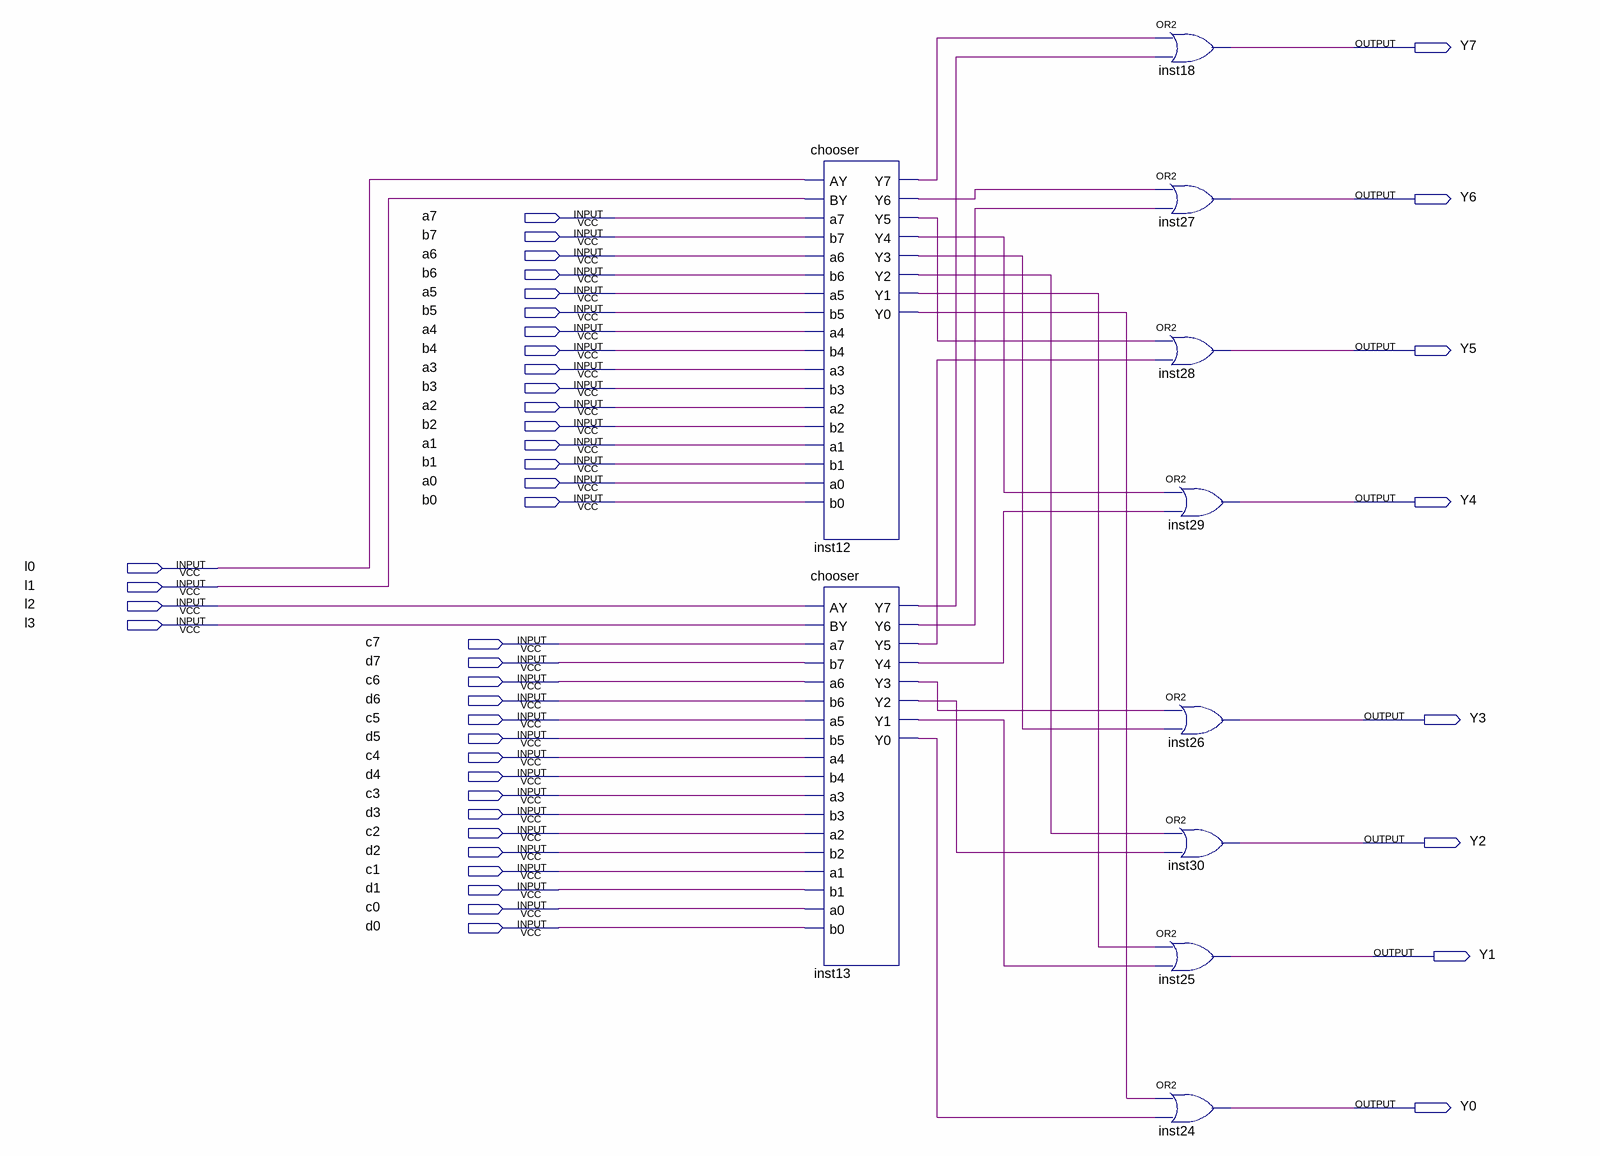
[diagram p0: schematic sheet]
// Quartus schematic chooser4-1.bdf as structural Verilog: 10 symbols, 44 pins
module \chooser4-1  (
  input  a7,
  input  b7,
  input  a6,
  input  b6,
  input  a5,
  input  b5,
  input  a4,
  input  b4,
  input  a3,
  input  b3,
  input  a2,
  input  b2,
  input  a1,
  input  b1,
  input  a0,
  input  b0,
  input  l0,
  input  l1,
  input  l2,
  input  l3,
  input  c7,
  input  d7,
  input  c6,
  input  d6,
  input  c5,
  input  d5,
  input  c4,
  input  d4,
  input  c3,
  input  d3,
  input  c2,
  input  d2,
  input  c1,
  input  d1,
  input  c0,
  input  d0,
  output Y7,
  output Y6,
  output Y5,
  output Y4,
  output Y3,
  output Y2,
  output Y1,
  output Y0
);

  wire inst12_y0, inst12_y1, inst12_y2, inst12_y3, inst12_y4, inst12_y5, inst12_y6, inst12_y7, inst13_y0,
       inst13_y1, inst13_y2, inst13_y3, inst13_y4, inst13_y5, inst13_y6, inst13_y7;

  chooser inst12 (
    .AY(l0), .BY(l1), .a7(a7), .b7(b7), .a6(a6), .b6(b6), .a5(a5), .b5(b5), .a4(a4), .b4(b4), .a3(a3),
    .b3(b3), .a2(a2), .b2(b2), .a1(a1), .b1(b1), .a0(a0), .b0(b0), .Y7(inst12_y7), .Y6(inst12_y6),
    .Y5(inst12_y5), .Y4(inst12_y4), .Y3(inst12_y3), .Y2(inst12_y2), .Y1(inst12_y1), .Y0(inst12_y0));
  chooser inst13 (
    .AY(l2), .BY(l3), .a7(c7), .b7(d7), .a6(c6), .b6(d6), .a5(c5), .b5(d5), .a4(c4), .b4(d4), .a3(c3),
    .b3(d3), .a2(c2), .b2(d2), .a1(c1), .b1(d1), .a0(c0), .b0(d0), .Y7(inst13_y7), .Y6(inst13_y6),
    .Y5(inst13_y5), .Y4(inst13_y4), .Y3(inst13_y3), .Y2(inst13_y2), .Y1(inst13_y1), .Y0(inst13_y0));
  or inst18 (Y7, inst12_y7, inst13_y7);
  or inst27 (Y6, inst12_y6, inst13_y6);
  or inst28 (Y5, inst12_y5, inst13_y5);
  or inst29 (Y4, inst12_y4, inst13_y4);
  or inst26 (Y3, inst13_y3, inst12_y3);
  or inst30 (Y2, inst12_y2, inst13_y2);
  or inst25 (Y1, inst12_y1, inst13_y1);
  or inst24 (Y0, inst12_y0, inst13_y0);
endmodule
